# Altium project 电源板.PrjPCB
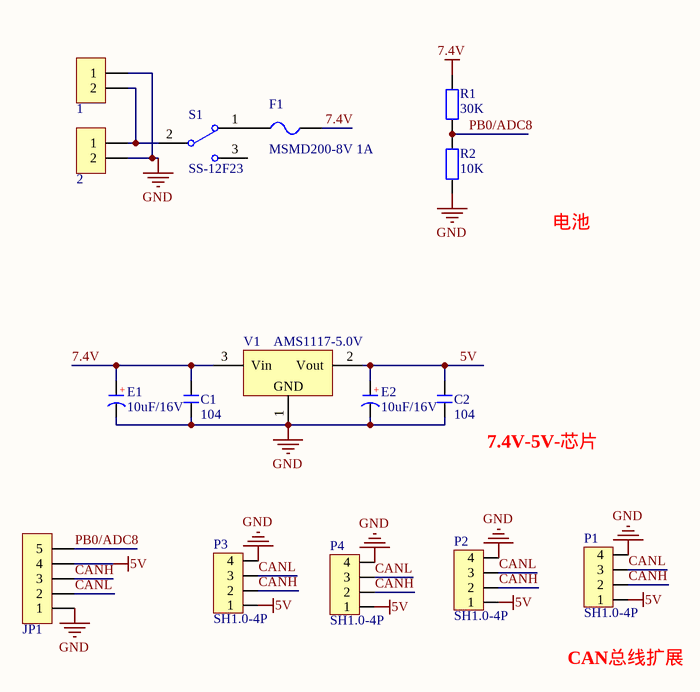
[diagram p0: 电源板.SchDoc]
1 sheet, 16 parts. Net scope: global (net labels, ports and power ports of the same name join across sheets).
Board file: 电源板.PcbDoc

## Sheet 电源板.SchDoc
size A4

### Parts
1  HDR-1X2  [XH2.54-WI-2P]  (value not drawn)
2  HDR-1X2  [XH2.54-WI-2P]  (value not drawn)
C1  104  [C 0603_L]
C2  104  [C 0603_L]
E1  10uF/16V  [CD A(3216)]
E2  10uF/16V  [CD A(3216)]
F1  MSMD200-8V 1A  [FU 1206]
JP1  HDR-1X5  [HDR2.54-LI-5P]  (value not drawn)
P1  SH1.0-4P  [SH1.0-4P]
P2  SH1.0-4P  [SH1.0-4P]
P3  SH1.0-4P  [SH1.0-4P]
P4  SH1.0-4P  [SH1.0-4P]
R1  30K  [R 0603_L]
R2  10K  [R 0603_L]
S1  SS-12F23  [SK-12D07VG3]
V1  AMS1117-5.0V  [SOT223_L]

### Nets
5V: C2.2 E2.1(A) JP1.4 P1.1 P2.1 P3.1 P4.1 V1.2(Vout)
7.4V: C1.2 E1.1(A) F1.2 R1.2 V1.3(Vin)
GND: 1.1 2.2 C1.1 C2.1 E1.2(K) E2.2(K) JP1.1 P1.4 P2.4 P3.4 P4.4 R2.1 V1.1(GND)
CANH: JP1.3 P1.2 P2.2 P3.2 P4.2
CANL: JP1.2 P1.3 P2.3 P3.3 P4.3
PB0/ADC8: JP1.5 R1.1 R2.2
Net1_2: 1.2 2.1 S1.2
NetF1_1: F1.1 S1.1

Not connected (* = marked no-connect by the designer): S1 3

### Notes on the sheet
- 电池
- (near C2) 7.4V-5V-芯片
- (near P1) CAN总线扩展
- (in symbol CT) +

### Library data of the parts
1 2 = Header 2: 2P接插件; 版权归属: 封装库来自淘宝 ID：黄晶宝石; BOM名称: 2P接插件; 联系售后: https://shop463601444.taobao.com
C1 C2 = C: 贴片电容; BOM名称: 无极性贴片电容; 淘宝ID: 封装库来自淘宝 ID：黄晶宝石; 联系售后，技术支持: https://shop463601444.taobao.com; 唯一出售店铺网址: https://shop463601444.taobao.com
E1 E2 = CT: 贴片钽电容; 淘宝ID: 封装库来自淘宝 ID：黄晶宝石; BOM名称: 贴片钽电容; 联系售后: https://shop463601444.taobao.com
F1 = FU: 贴片保险丝; 版权归属: 封装库来自淘宝卖家 ID：黄晶宝石; BOM名称: 贴片保险丝; 学习资源: https://shop463601444.taobao.com
JP1 = Header 5: 5P接插件; 版权归属: 封装库来自淘宝 ID：黄晶宝石; System: Connector; BOM名称: 5P接插件; 学习资源: https://shop463601444.taobao.com
R1 R2 = R: 贴片电阻; 版权归属: 来自淘宝 ID：黄晶宝石; 封装库来自淘宝卖家 ID：黄晶宝石: 其他店铺购入均为盗版，不享受售后技术支持服务，请立即申请退款; BOM名称: 贴片电阻; 联系售后: https://shop463601444.taobao.com
S1 = SSW-1P: 1路波动开关; BOM名称: 波动开关; 版权归属: 源创客; 学习资源: www.ooocke.com
V1 = AMS1117: 三端稳压芯片; BOM名称: 稳压芯片; 淘宝ID: 封装库来自淘宝 ID：黄晶宝石; 欢迎光临淘宝店铺: https://shop463601444.taobao.com